# Altium schematic sheet Smart Driver Circuit.SchDoc
size A4; SheetNumber: 6; SheetTotal: 9
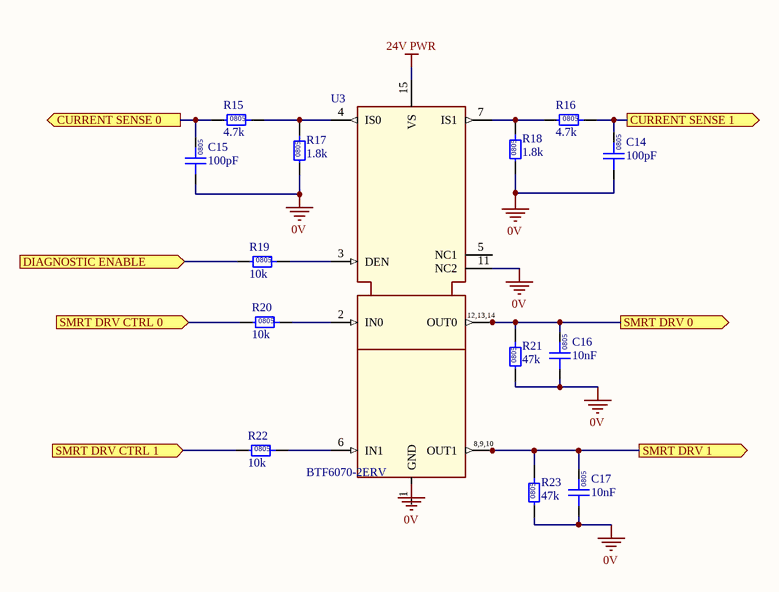
[diagram p0: Smart Driver Circuit.SchDoc]

## Parts
C14  100pF  [0805]
C15  100pF  [0805]
C16  10nF  [0805]
C17  10nF  [0805]
R15  4.7k  [0805]
R16  4.7k  [0805]
R17  1.8k  [0805]
R18  1.8k  [0805]
R19  10k  [0805]
R20  10k  [0805]
R21  47k  [0805]
R22  10k  [0805]
R23  47k  [0805]
U3  BTF6070-2ERV  [SOIC127P600X115-15N-V1]

## Ports
CURRENT SENSE 0 (out), CURRENT SENSE 1 (out), DIAGNOSTIC ENABLE (in), SMRT DRV 0 (out), SMRT DRV 1 (out), SMRT DRV CTRL 0 (in), SMRT DRV CTRL 1 (in)

## Nets
0V: C14.1 C15.1 C16.1 C17.1 R17.1 R18.1 R21.1 R23.1 U3.11(NC2)
24V PWR: U3.15(VS)
CURRENT SENSE 0: C15.2 R15.1 ; port CURRENT SENSE 0
CURRENT SENSE 1: C14.2 R16.2 ; port CURRENT SENSE 1
DIAGNOSTIC ENABLE: R19.1 ; port DIAGNOSTIC ENABLE
SMRT DRV 0: C16.2 R21.2 U3.12(OUT0) U3.13(OUT0) U3.14(OUT0) ; port SMRT DRV 0
SMRT DRV 1: C17.2 R23.2 U3.8(OUT1) U3.9(OUT1) U3.10(OUT1) ; port SMRT DRV 1
SMRT DRV CTRL 0: R20.1 ; port SMRT DRV CTRL 0
SMRT DRV CTRL 1: R22.1 ; port SMRT DRV CTRL 1
NetR15_2: R15.2 R17.2 U3.4(IS0)
NetR16_1: R16.1 R18.2 U3.7(IS1)
NetR19_2: R19.2 U3.3(DEN)
NetR20_2: R20.2 U3.2(IN0)
NetR22_2: R22.2 U3.6(IN1)

Not connected (* = marked no-connect by the designer): U3 1(GND) 5(NC1)

## Notes on the sheet
- Labels drawn without touching a wire or pin: 0V
- (in symbol BTF60702ERVXUMA1) 12,13,14; 8,9,10
- (in symbol GCM2165C1H101JA16D) 0805
- (in symbol GCM2195C1H103JA16D) 0805
- (in symbol RC0805FR071K8L) 0805
- (in symbol RC0805FR074K7L) 0805
- (in symbol RC0805FR0710KL) 0805
- (in symbol RC0805FR0747KL) 0805

## Library data of the parts
C14 C15 = GCM2165C1H101JA16D: Manufacturer: muRata; Rated Voltage: 50V; Tolerance: ±5%; Material: MLCC; Temperature Rating: C0G, NP0; Part Number: GCM2165C1H101JA16D; Value: 100pF; Digikey Part Number: 490-8031-1-ND
C16 C17 = GCM2195C1H103JA16D: Manufacturer: muRata; Rated Voltage: 50V; Tolerance: ±5%; Material: MLCC; Temperature Rating: C0G, NP0; Part Number: GCM2195C1H103JA16D; Value: 10nF; Digikey Part Number: 490-4783-1-ND
R15 R16 = RC0805FR074K7L: Manufacturer: YAGEO; Tolerance: 0.01; Rated Power: 0.125W; Part Number: RC0805FR074K7L; Value: 4.7k; Material: FR-07; Digikey Part Number: 311-4.70KCRCT-ND
R17 R18 = RC0805FR071K8L: Manufacturer: YAGEO; Tolerance: 0.01; Rated Power: 0.125W; Part Number: RC0805FR071K8L; Value: 1.8k; Material: FR-07; Digikey Part Number: 311-1.80KCRCT-ND
R19 R20 R22 = RC0805FR0710KL: Manufacturer: YAGEO; Tolerance: 0.01; Rated Power: 0.125W; Part Number: RC0805FR0710KL; Value: 10k; Material: FR-07; Digikey Part Number: 311-10.0KCRCT-ND
R21 R23 = RC0805FR0747KL: Manufacturer: YAGEO; Tolerance: 0.01; Rated Power: 0.125W; Part Number: RC0805FR0747KL; Value: 47k; Material: FR-07; Digikey Part Number: 311-47.0KCRCT-ND
U3 = BTF60702ERVXUMA1: Smart High-Side Power Switch, Dual Channel; Manufacturer: Infineon Technologies; PackageReference: PG-TDSO-14-21; ManufacturerPartNumber: BTF6070-2ERV; Part Number: BTF60702ERVXUMA1; Digikey Part Number: 448-BTF60702ERVXUMA1TR-ND; Digikey Link: https://www.digikey.com.au/en/products/detail/infineon-technologies/BTF60702ERVXUMA1/10379692